# EAGLE design hoop_v2 (EAGLE 9.6.2)
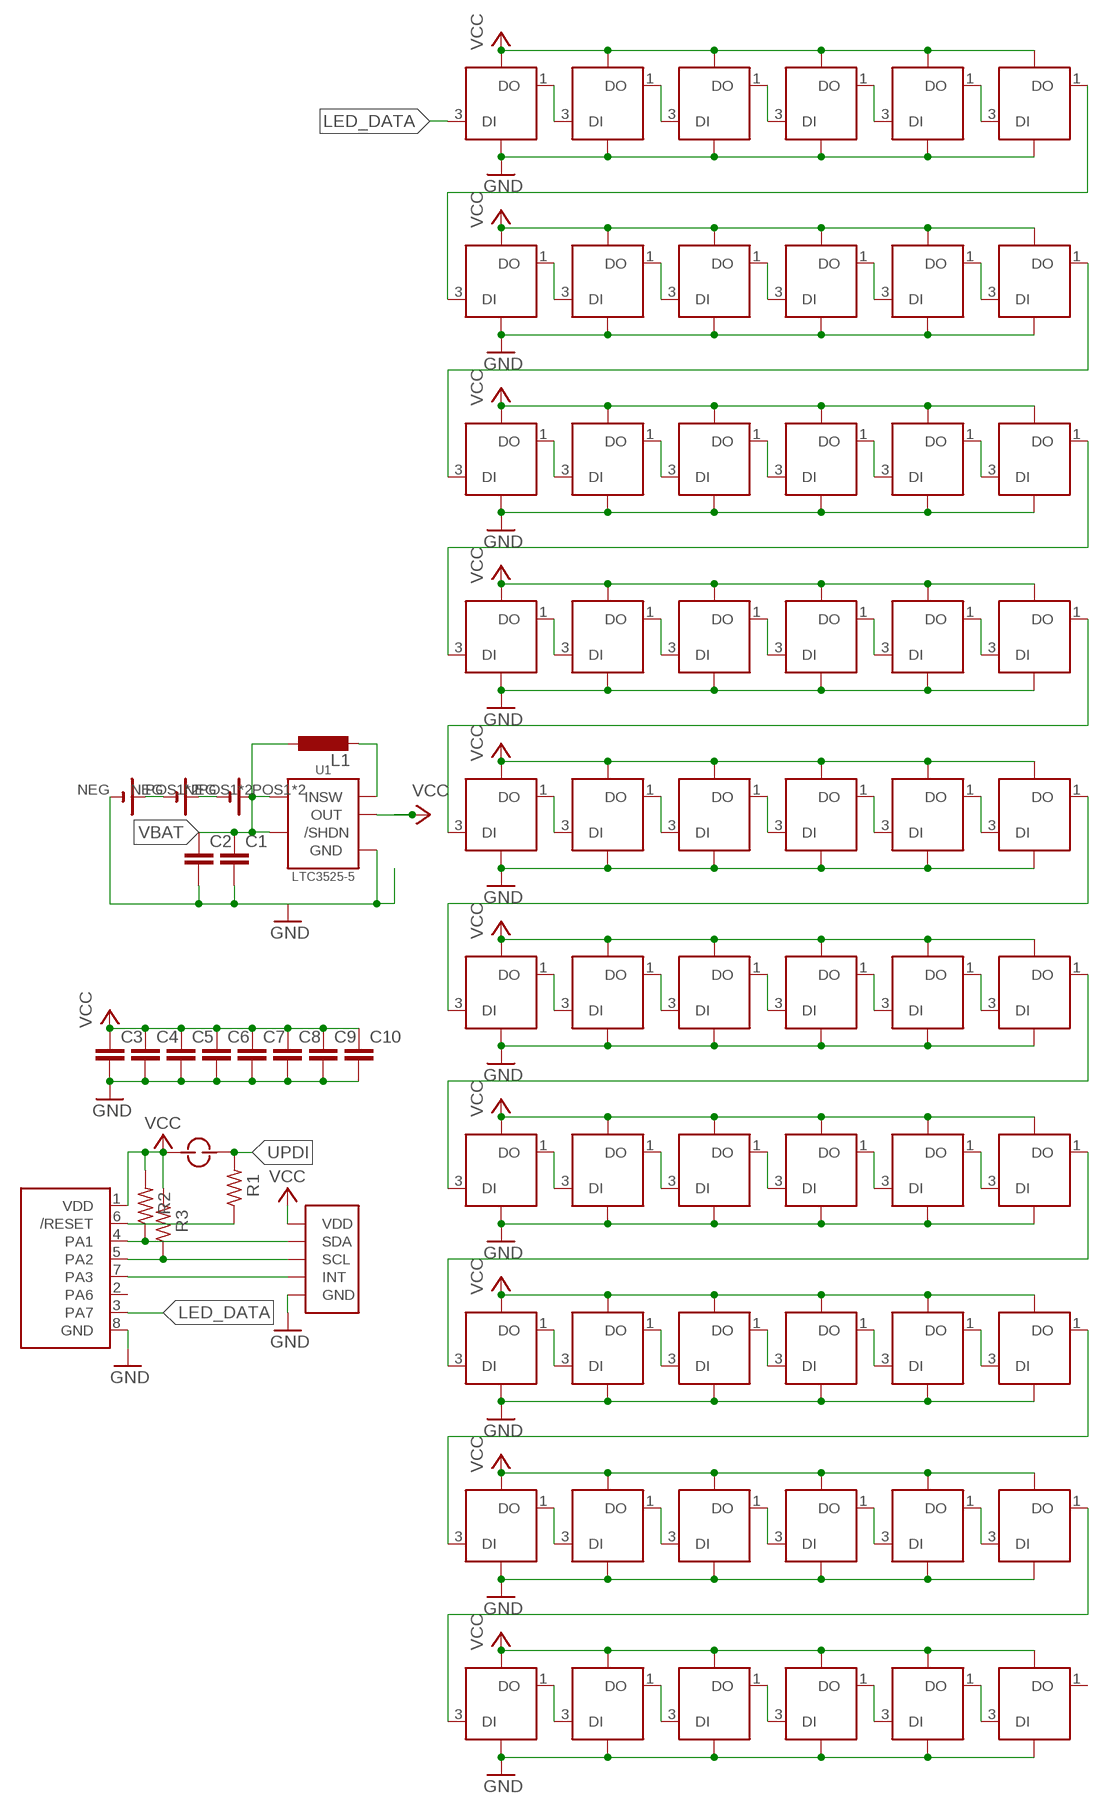
[diagram p0: schematic, sheet 1]

## Parts
B1  P312  [P312_CLIP]
B2  P312  [P312_CLIP]
B3  P312  [P312_CLIP]
C1  C-EUC0805  [C0805]
C2  C-EUC0805  [C0805]
C3  C-EUC0805  [C0805]
C4  C-EUC0805  [C0805]
C5  C-EUC0805  [C0805]
C6  C-EUC0805  [C0805]
C7  C-EUC0805  [C0805]
C8  C-EUC0805  [C0805]
C9  C-EUC0805  [C0805]
C10  C-EUC0805  [C0805]
D1  SMD-LX0707RGB-TR  [SMD-LX0707RGB-TR]
D2  SMD-LX0707RGB-TR  [SMD-LX0707RGB-TR]
D3  SMD-LX0707RGB-TR  [SMD-LX0707RGB-TR]
D4  SMD-LX0707RGB-TR  [SMD-LX0707RGB-TR]
D5  SMD-LX0707RGB-TR  [SMD-LX0707RGB-TR]
D6  SMD-LX0707RGB-TR  [SMD-LX0707RGB-TR]
D7  SMD-LX0707RGB-TR  [SMD-LX0707RGB-TR]
D8  SMD-LX0707RGB-TR  [SMD-LX0707RGB-TR]
D9  SMD-LX0707RGB-TR  [SMD-LX0707RGB-TR]
D10  SMD-LX0707RGB-TR  [SMD-LX0707RGB-TR]
D11  SMD-LX0707RGB-TR  [SMD-LX0707RGB-TR]
D12  SMD-LX0707RGB-TR  [SMD-LX0707RGB-TR]
D13  SMD-LX0707RGB-TR  [SMD-LX0707RGB-TR]
D14  SMD-LX0707RGB-TR  [SMD-LX0707RGB-TR]
D15  SMD-LX0707RGB-TR  [SMD-LX0707RGB-TR]
D16  SMD-LX0707RGB-TR  [SMD-LX0707RGB-TR]
D17  SMD-LX0707RGB-TR  [SMD-LX0707RGB-TR]
D18  SMD-LX0707RGB-TR  [SMD-LX0707RGB-TR]
D19  SMD-LX0707RGB-TR  [SMD-LX0707RGB-TR]
D20  SMD-LX0707RGB-TR  [SMD-LX0707RGB-TR]
D21  SMD-LX0707RGB-TR  [SMD-LX0707RGB-TR]
D22  SMD-LX0707RGB-TR  [SMD-LX0707RGB-TR]
D23  SMD-LX0707RGB-TR  [SMD-LX0707RGB-TR]
D24  SMD-LX0707RGB-TR  [SMD-LX0707RGB-TR]
D25  SMD-LX0707RGB-TR  [SMD-LX0707RGB-TR]
D26  SMD-LX0707RGB-TR  [SMD-LX0707RGB-TR]
D27  SMD-LX0707RGB-TR  [SMD-LX0707RGB-TR]
D28  SMD-LX0707RGB-TR  [SMD-LX0707RGB-TR]
D29  SMD-LX0707RGB-TR  [SMD-LX0707RGB-TR]
D30  SMD-LX0707RGB-TR  [SMD-LX0707RGB-TR]
D31  SMD-LX0707RGB-TR  [SMD-LX0707RGB-TR]
D32  SMD-LX0707RGB-TR  [SMD-LX0707RGB-TR]
D33  SMD-LX0707RGB-TR  [SMD-LX0707RGB-TR]
D34  SMD-LX0707RGB-TR  [SMD-LX0707RGB-TR]
D35  SMD-LX0707RGB-TR  [SMD-LX0707RGB-TR]
D36  SMD-LX0707RGB-TR  [SMD-LX0707RGB-TR]
D37  SMD-LX0707RGB-TR  [SMD-LX0707RGB-TR]
D38  SMD-LX0707RGB-TR  [SMD-LX0707RGB-TR]
D39  SMD-LX0707RGB-TR  [SMD-LX0707RGB-TR]
D40  SMD-LX0707RGB-TR  [SMD-LX0707RGB-TR]
D41  SMD-LX0707RGB-TR  [SMD-LX0707RGB-TR]
D42  SMD-LX0707RGB-TR  [SMD-LX0707RGB-TR]
D43  SMD-LX0707RGB-TR  [SMD-LX0707RGB-TR]
D44  SMD-LX0707RGB-TR  [SMD-LX0707RGB-TR]
D45  SMD-LX0707RGB-TR  [SMD-LX0707RGB-TR]
D46  SMD-LX0707RGB-TR  [SMD-LX0707RGB-TR]
D47  SMD-LX0707RGB-TR  [SMD-LX0707RGB-TR]
D48  SMD-LX0707RGB-TR  [SMD-LX0707RGB-TR]
D49  SMD-LX0707RGB-TR  [SMD-LX0707RGB-TR]
D50  SMD-LX0707RGB-TR  [SMD-LX0707RGB-TR]
D51  SMD-LX0707RGB-TR  [SMD-LX0707RGB-TR]
D52  SMD-LX0707RGB-TR  [SMD-LX0707RGB-TR]
D53  SMD-LX0707RGB-TR  [SMD-LX0707RGB-TR]
D54  SMD-LX0707RGB-TR  [SMD-LX0707RGB-TR]
D55  SMD-LX0707RGB-TR  [SMD-LX0707RGB-TR]
D56  SMD-LX0707RGB-TR  [SMD-LX0707RGB-TR]
D57  SMD-LX0707RGB-TR  [SMD-LX0707RGB-TR]
D58  SMD-LX0707RGB-TR  [SMD-LX0707RGB-TR]
D59  SMD-LX0707RGB-TR  [SMD-LX0707RGB-TR]
D60  SMD-LX0707RGB-TR  [SMD-LX0707RGB-TR]
J1  JMP  [SOLDER_JMP]
L1  L-EUL3216C  [L3216C]
R1  R-US_R0805  [R0805]
R2  R-US_R0805  [R0805]
R3  R-US_R0805  [R0805]
U1  LTC3525  [SOP65P210X100-6N]
U2  MXC6255XU  [RESCAV110P300X300X105-6N]
U3  ATTINY202  [SOIC127P600X175-8N]

## Nets
GND: B1.NEG(-) C1.2 C2.2 C3.2 C4.2 C5.2 C6.2 C7.2 C8.2 C9.2 C10.2 D1.4(GND) D2.4(GND) D3.4(GND) D4.4(GND) D5.4(GND) D6.4(GND) D7.4(GND) D8.4(GND) D9.4(GND) D10.4(GND) D11.4(GND) D12.4(GND) D13.4(GND) D14.4(GND) D15.4(GND) D16.4(GND) D17.4(GND) D18.4(GND) D19.4(GND) D20.4(GND) D21.4(GND) D22.4(GND) D23.4(GND) D24.4(GND) D25.4(GND) D26.4(GND) D27.4(GND) D28.4(GND) D29.4(GND) D30.4(GND) D31.4(GND) D32.4(GND) D33.4(GND) D34.4(GND) D35.4(GND) D36.4(GND) D37.4(GND) D38.4(GND) D39.4(GND) D40.4(GND) D41.4(GND) D42.4(GND) D43.4(GND) D44.4(GND) D45.4(GND) D46.4(GND) D47.4(GND) D48.4(GND) D49.4(GND) D50.4(GND) D51.4(GND) D52.4(GND) D53.4(GND) D54.4(GND) D55.4(GND) D56.4(GND) D57.4(GND) D58.4(GND) D59.4(GND) D60.4(GND) U1.2(GND) U1.5(GND) U2.6(GND) U3.8(GND)
LED_DATA: D1.3(DI) U3.3(PA7)
N$1: D1.1(DO) D2.3(DI)
N$2: D2.1(DO) D3.3(DI)
N$3: D3.1(DO) D4.3(DI)
N$4: D4.1(DO) D5.3(DI)
N$5: D5.1(DO) D6.3(DI)
N$6: D7.1(DO) D8.3(DI)
N$7: D8.1(DO) D9.3(DI)
N$8: D9.1(DO) D10.3(DI)
N$9: D10.1(DO) D11.3(DI)
N$10: D11.1(DO) D12.3(DI)
N$11: D13.1(DO) D14.3(DI)
N$12: D14.1(DO) D15.3(DI)
N$13: D15.1(DO) D16.3(DI)
N$14: D16.1(DO) D17.3(DI)
N$15: D17.1(DO) D18.3(DI)
N$16: D19.1(DO) D20.3(DI)
N$17: D20.1(DO) D21.3(DI)
N$18: D21.1(DO) D22.3(DI)
N$19: D22.1(DO) D23.3(DI)
N$20: D23.1(DO) D24.3(DI)
N$21: D25.1(DO) D26.3(DI)
N$22: D26.1(DO) D27.3(DI)
N$23: D27.1(DO) D28.3(DI)
N$24: D28.1(DO) D29.3(DI)
N$25: B1.POS1(+) B1.POS2(+) B2.NEG(-)
N$26: B2.POS1(+) B2.POS2(+) B3.NEG(-)
N$28: D29.1(DO) D30.3(DI)
N$29: D31.1(DO) D32.3(DI)
N$30: D32.1(DO) D33.3(DI)
N$31: D33.1(DO) D34.3(DI)
N$32: D34.1(DO) D35.3(DI)
N$33: D35.1(DO) D36.3(DI)
N$34: D37.1(DO) D38.3(DI)
N$35: D38.1(DO) D39.3(DI)
N$36: D39.1(DO) D40.3(DI)
N$37: D40.1(DO) D41.3(DI)
N$38: D41.1(DO) D42.3(DI)
N$39: D43.1(DO) D44.3(DI)
N$40: D44.1(DO) D45.3(DI)
N$41: D45.1(DO) D46.3(DI)
N$42: D46.1(DO) D47.3(DI)
N$43: D47.1(DO) D48.3(DI)
N$44: D49.1(DO) D50.3(DI)
N$45: D50.1(DO) D51.3(DI)
N$46: D51.1(DO) D52.3(DI)
N$47: D52.1(DO) D53.3(DI)
N$48: D53.1(DO) D54.3(DI)
N$49: D55.1(DO) D56.3(DI)
N$50: D56.1(DO) D57.3(DI)
N$51: D57.1(DO) D58.3(DI)
N$52: D58.1(DO) D59.3(DI)
N$53: D59.1(DO) D60.3(DI)
N$54: D6.1(DO) D7.3(DI)
N$55: D12.1(DO) D13.3(DI)
N$56: D18.1(DO) D19.3(DI)
N$57: D24.1(DO) D25.3(DI)
N$58: D30.1(DO) D31.3(DI)
N$59: D36.1(DO) D37.3(DI)
N$60: D42.1(DO) D43.3(DI)
N$61: D48.1(DO) D49.3(DI)
N$62: D54.1(DO) D55.3(DI)
N$64: L1.2 U1.6(SW)
N$66: U2.1(INT) U3.7(PA3)
N$69: R1.1 U3.6(/RESET)
SCL: R3.1 U2.4(SCL) U3.5(PA2)
SDA: R2.1 U2.5(SDA) U3.4(PA1)
UPDI: J1.P$2 R1.2
VBAT: B3.POS1(+) B3.POS2(+) C1.1 C2.1 L1.1 U1.1(/SHDN) U1.3(IN)
VCC: C3.1 C4.1 C5.1 C6.1 C7.1 C8.1 C9.1 C10.1 D1.2(VDD) D2.2(VDD) D3.2(VDD) D4.2(VDD) D5.2(VDD) D6.2(VDD) D7.2(VDD) D8.2(VDD) D9.2(VDD) D10.2(VDD) D11.2(VDD) D12.2(VDD) D13.2(VDD) D14.2(VDD) D15.2(VDD) D16.2(VDD) D17.2(VDD) D18.2(VDD) D19.2(VDD) D20.2(VDD) D21.2(VDD) D22.2(VDD) D23.2(VDD) D24.2(VDD) D25.2(VDD) D26.2(VDD) D27.2(VDD) D28.2(VDD) D29.2(VDD) D30.2(VDD) D31.2(VDD) D32.2(VDD) D33.2(VDD) D34.2(VDD) D35.2(VDD) D36.2(VDD) D37.2(VDD) D38.2(VDD) D39.2(VDD) D40.2(VDD) D41.2(VDD) D42.2(VDD) D43.2(VDD) D44.2(VDD) D45.2(VDD) D46.2(VDD) D47.2(VDD) D48.2(VDD) D49.2(VDD) D50.2(VDD) D51.2(VDD) D52.2(VDD) D53.2(VDD) D54.2(VDD) D55.2(VDD) D56.2(VDD) D57.2(VDD) D58.2(VDD) D59.2(VDD) D60.2(VDD) J1.P$1 R2.2 R3.2 U1.4(OUT) U2.3(VDD) U3.1(VDD)
Unconnected: D60.1(DO) U3.2(PA6)

## Library data of the parts
B1-B3 = earring:P312
C1-C10 = rcl:C-EU: CAPACITOR, European symbol; SPICEPREFIX: C
D1-D60 = earring:SMD-LX0707RGB-TR
J1 = earring:JMP
L1 = rcl:L-EU: INDUCTOR, European symbol; SPICEPREFIX: L
R1-R3 = rcl:R-US_: RESISTOR, American symbol; SPICEPREFIX: R
U1 = earring:LTC3525
U2 = earring:MXC6255XU
U3 = earring:ATTINY202

## Board
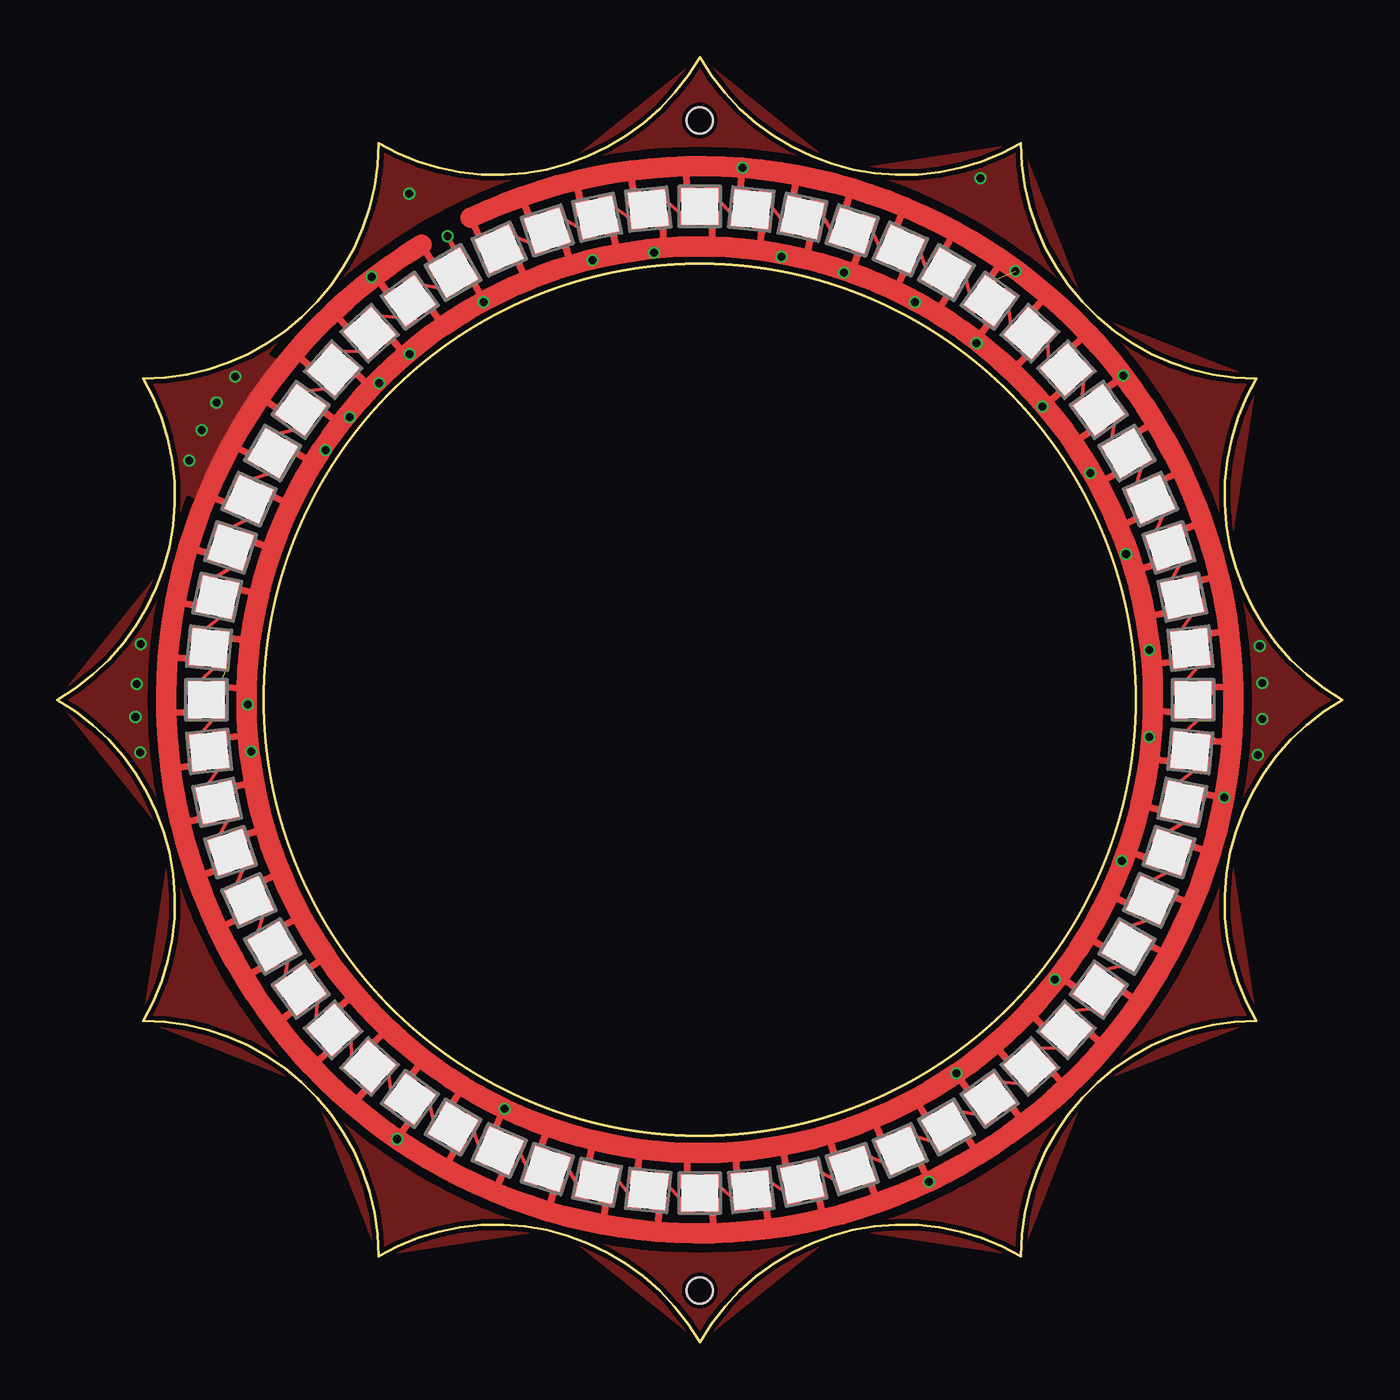
[diagram p1: board, top side]
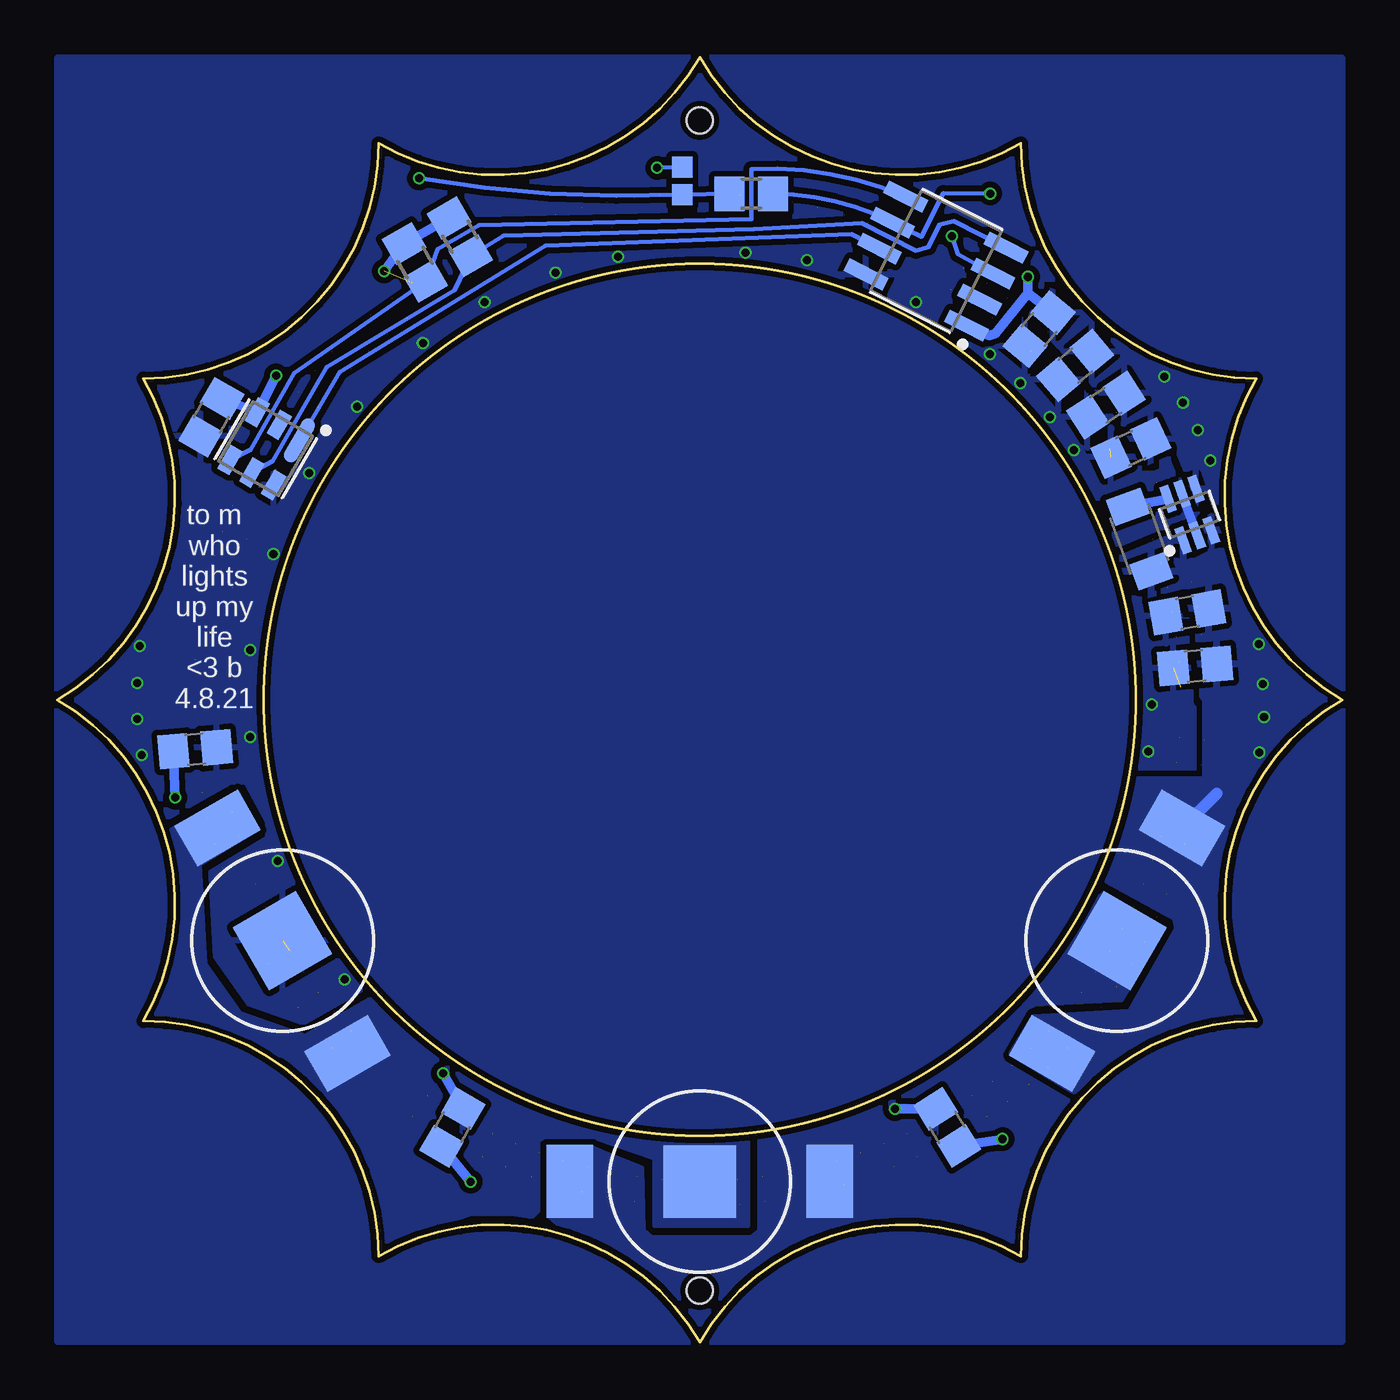
[diagram p2: board, bottom side, seen from below]

Size 56 x 56 mm. Coordinates in mm from the lower left corner, seen from the top.
Outline: 56,28 arc-90 52.25,42 arc-90 42,52.25 arc-90 28,56 arc-90 14,52.25 arc-90 3.75,42 arc-90 0,28 arc-90 3.75,14 arc-90 14,3.75 arc-90 28,0 arc-90 42,3.75 arc-90 52.25,14 arc-90 56,28
Outline: circle at 28,28 radius 19
Copper layers (1*16): Top 0.035559375mm / dielectric 1.6mm / Bottom 0.035559375mm
Design rules "jlcpcb2layer *": minimum track width 5mil, minimum drill 12mil, track to track 5mil, track to pad 5mil, pad to pad 5mil, via to via 5mil, smd to smd 5mil, copper to edge 8mil, drill to drill 6mil, minimum pad ring 5mil, minimum via ring 3mil, stop-mask expansion 2.5mil, vias tented up to drill 25mil, thermal gap 10mil
Holes 1.15 mm at 28,53.25 28,2.25

### Footprints (pad centres in the part's own frame; a part is rotated, then mirrored left to right if it is on the bottom)
P312_CLIP = smd 3.17 x 3.17: NEG 0,0 | smd 2.03 x 3.18: POS1 -5.665,0; POS2 5.665,0
C0805 = smd 1.3 x 1.5: 1 -0.95,0; 2 0.95,0
SMD-LX0707RGB-TR = smd 0.7 x 0.7: 1 0.55,0.55; 2 0.55,-0.55; 3 -0.55,-0.55; 4 -0.55,0.55
SOLDER_JMP = smd 0.9 x 0.9: P$1 -0.6,0; P$2 0.6,0
L3216C = smd 1.2 x 1.6: 1 -1.5,0; 2 1.5,0
R0805 = smd 1.3 x 1.5: 1 -0.95,0; 2 0.95,0
SOP65P210X100-6N = smd 1.186 x 0.397: 1 -0.962,0.65; 2 -0.962,0; 3 -0.962,-0.65; 4 0.962,-0.65; 5 0.962,0; 6 0.962,0.65
RESCAV110P300X300X105-6N = smd 2.1 x 0.6: 1 -1.05,1.1 | smd 1.2 x 0.6: 2 -1.2,0; 3 -1.2,-1.1; 4 1.2,-1.1; 5 1.2,0; 6 1.2,1.1
SOIC127P600X175-8N = smd 1.901 x 0.599: 1 -2.455,1.905; 2 -2.455,0.635; 3 -2.455,-0.635; 4 -2.455,-1.905; 5 2.455,-1.905; 6 2.455,-0.635; 7 2.455,0.635; 8 2.455,1.905

### Placement (x,y rotation side)
B1  46.19,17.5 300 bottom
B2  28,7 180 bottom
B3  9.81,17.5 60 bottom
C1  6.41,29.47 185 bottom
C2  6.75,31.81 190 bottom
C3  9.21,38.97 205 bottom
C4  13.21,44.15 230 bottom
C5  10.3,40.84 213 bottom
C6  49.29,40.31 240 bottom
C7  11.63,42.57 220 bottom
C8  38.78,9.36 60 bottom
C9  17.21,9.36 122 bottom
C10  50,25.84 5 bottom
D1  17.25,46.62 210 top
D2  15.36,45.39 216 top
D3  13.61,43.98 222 top
D4  12.02,42.39 228 top
D5  10.61,40.64 234 top
D6  9.38,38.75 240 top
D7  8.36,36.74 246 top
D8  7.55,34.64 252 top
D9  6.97,32.47 258 top
D10  6.62,30.25 264 top
D11  6.5,28 270 top
D12  6.62,25.75 276 top
D13  6.97,23.53 282 top
D14  7.55,21.36 288 top
D15  8.36,19.26 294 top
D16  9.38,17.25 300 top
D17  10.61,15.36 306 top
D18  12.02,13.61 312 top
D19  13.61,12.02 318 top
D20  15.36,10.61 324 top
D21  17.25,9.38 330 top
D22  19.26,8.36 336 top
D23  21.36,7.55 342 top
D24  23.53,6.97 348 top
D25  25.75,6.62 354 top
D26  28,6.5 0 top
D27  30.25,6.62 6 top
D28  32.47,6.97 12 top
D29  34.64,7.55 18 top
D30  36.74,8.36 24 top
D31  38.75,9.38 30 top
D32  40.64,10.61 36 top
D33  42.39,12.02 42 top
D34  43.98,13.61 48 top
D35  45.39,15.36 54 top
D36  46.62,17.25 60 top
D37  47.64,19.26 66 top
D38  48.45,21.36 72 top
D39  49.03,23.53 78 top
D40  49.38,25.75 84 top
D41  49.5,28 90 top
D42  49.38,30.25 96 top
D43  49.03,32.47 102 top
D44  48.45,34.64 108 top
D45  47.64,36.74 114 top
D46  46.62,38.75 120 top
D47  45.39,40.64 126 top
D48  43.98,42.39 132 top
D49  42.39,43.98 138 top
D50  40.64,45.39 144 top
D51  38.75,46.62 150 top
D52  36.74,47.64 156 top
D53  34.64,48.45 162 top
D54  32.47,49.03 168 top
D55  30.25,49.38 174 top
D56  28,49.5 180 top
D57  25.75,49.38 186 top
D58  23.53,49.03 192 top
D59  21.36,48.45 198 top
D60  19.26,47.64 204 top
J1  28.76,50.61 270 bottom
L1  8.83,35.01 110 bottom
R1  25.75,50.05 180 bottom
R2  38.45,48.18 120 bottom
R3  40.41,47.06 120 bottom
U1  6.65,36.07 110 bottom
U2  46.93,38.94 240 bottom
U3  17.7,47.12 153 bottom

### Tracks (layer width: path | path; a pad name or v marks a point on that pad's centre or on a via)
GND  (via drill 0.35)  (45 unrouted)
  Top 0.3: D1.4 18.57,45.36 | D2.4 16.81,44.28 | D3.4 15.17,43.02 | D4.4 13.67,41.6 | D5.4 12.33,40.03 | D6.4 11.15,38.32 | D7.4 10.17,36.51 | D8.4 9.38,34.6 | D9.4 8.79,32.61 | D10.4 8.41,30.58 | D11.4 8.25,28.52 | D12.4 8.3,26.45 | D13.4 8.57,24.4 | D14.4 9.06,22.39 | D15.4 9.75,20.44 | D16.4 10.64,18.57 | D17.4 11.72,16.81 | D18.4 12.98,15.17 | D19.4 14.4,13.67 | D20.4 15.97,12.33 | D21.4 17.68,11.15 | D22.4 v19.49,10.17 | D23.4 21.4,9.38 | D24.4 23.39,8.79 | D25.4 25.42,8.41 | D26.4 27.48,8.25 | D27.4 29.55,8.3 | D28.4 31.6,8.57 | D29.4 33.61,9.06 | D30.4 35.56,9.75 | D31.4 37.43,10.64 | D32.4 v39.19,11.72 | D33.4 40.83,12.98 | D34.4 42.33,14.4 | D35.4 43.67,15.97 | D36.4 44.84,17.68 | D37.4 45.83,19.49 | D38.4 46.62,21.4 | D39.4 47.21,23.39 | D40.4 47.59,25.42 | D41.4 47.75,27.48 | D42.4 47.7,29.55 | D43.4 47.43,31.6 | D44.4 46.94,33.61 | D45.4 46.25,35.56 | D46.4 45.36,37.43 | D47.4 44.28,39.19 | D48.4 43.02,40.83 | D49.4 41.6,42.33 | D50.4 40.03,43.67 | D51.4 38.32,44.84 | D52.4 36.51,45.83 | D53.4 34.6,46.62 | D54.4 32.61,47.21 | D55.4 30.58,47.59 | D56.4 28.52,47.75 | D57.4 26.45,47.7 | D58.4 24.4,47.43 | D59.4 22.39,46.94 | D60.4 20.44,46.25
  Top 0.9: 18.57,45.36 arc6 16.81,44.28 arc6 15.17,43.02 arc6 13.67,41.6 arc6 12.33,40.03 arc6 11.15,38.32 arc6 10.17,36.51 arc6 9.38,34.6 arc6 8.79,32.61 arc6 8.41,30.58 arc6 8.25,28.52 arc6 8.3,26.45 arc6 8.57,24.4 arc6 9.06,22.39 arc6 9.75,20.44 arc6 10.64,18.57 arc6 11.72,16.81 arc6 12.98,15.17 arc6 14.4,13.67 arc6 15.97,12.33 arc6 17.68,11.15 arc6 v19.49,10.17 arc6 21.4,9.38 arc6 23.39,8.79 arc6 25.42,8.41 arc6 27.48,8.25 arc6 29.55,8.3 arc6 31.6,8.57 arc6 33.61,9.06 arc6 35.56,9.75 arc6 37.43,10.64 arc6 v39.19,11.72 arc6 40.83,12.98 arc6 42.33,14.4 arc6 43.67,15.97 arc6 44.84,17.68 arc6 45.83,19.49 arc6 46.62,21.4 arc6 47.21,23.39 arc6 47.59,25.42 arc6 47.75,27.48 arc6 47.7,29.55 arc6 47.43,31.6 arc6 46.94,33.61 arc6 46.25,35.56 arc6 45.36,37.43 arc6 44.28,39.19 arc6 43.02,40.83 arc6 41.6,42.33 arc6 40.03,43.67 arc6 38.32,44.84 arc6 36.51,45.83 arc6 34.6,46.62 arc6 32.61,47.21 arc6 30.58,47.59 arc6 28.52,47.75 arc6 26.45,47.7 arc6 24.4,47.43 arc6 22.39,46.94 arc6 20.44,46.25 arc6 18.57,45.36
  Bottom 0.406: C9.2 v19.49,10.17 | C8.2 v39.19,11.72 | U1.2 U1.5
  other vias: 8.29,27.8 45.02,37.87 46.58,34.35 42.94,40.78 47.59,26.38 47.59,30.18 46.41,20.97 43.48,15.81 52.52,27.16 11.7,38.87 12.74,40.32 14.03,41.8 15.35,43.07 8.45,25.74 18.58,45.33 23.33,47.16 26,47.49 31.56,47.31 34.28,46.62 37.38,45.33 40.07,43.55 52.31,25.59 52.52,28.74 52.42,30.34
  pour Bottom (isolate 0.254, rank 3): 0,0 56,0 56,56 1,56 0,56
  pour Top: 51.4,22.25 51.46,22.5 51.52,22.74 51.57,22.99 51.62,23.24 51.67,23.48 51.72,23.73 51.76,23.98 51.8,24.23 51.84,24.48 51.88,24.73 51.91,24.98 51.94,25.23 51.97,25.48 51.99,25.73 52.02,25.98 52.04,26.23 52.05,26.49 52.07,26.74 52.08,26.99 52.09,27.24 52.09,27.5 52.1,27.75 52.1,28 52.1,28.25 52.09,28.5 52.09,28.76 52.08,29.01 52.07,29.26 52.05,29.51 52.04,29.77 52.02,30.02 51.99,30.27 51.97,30.52 51.94,30.77 51.91,31.02 51.88,31.27 51.84,31.52 51.8,31.77 51.76,32.02 51.72,32.27 51.67,32.52 51.62,32.76 51.57,33.01 51.52,33.26 51.46,33.5 51.4,33.75 56,28
LED_DATA  (via drill 0.35)
  Top 0.203: D1.3 v17.02,48.21
  Bottom 0.203: v17.02,48.21 16.74,47.42 U3.3
N$1  (2 unrouted)
  Top 0.152: D1.1 D2.3
N$2  (2 unrouted)
  Top 0.152: D2.1 D3.3
N$3  (1 unrouted)
  Top 0.152: D3.1 D4.3
N$4
  Top 0.152: D4.1 D5.3
N$5  (2 unrouted)
  Top 0.152: D5.1 D6.3
N$6  (2 unrouted)
  Top 0.152: D7.1 D8.3
N$7  (2 unrouted)
  Top 0.152: D8.1 D9.3
N$8  (2 unrouted)
  Top 0.152: D9.1 D10.3
N$9  (1 unrouted)
  Top 0.152: D10.1 D11.3
N$10  (1 unrouted)
  Top 0.152: D11.1 D12.3
N$11  (1 unrouted)
  Top 0.152: D13.1 D14.3
N$12  (2 unrouted)
  Top 0.152: D14.1 D15.3
N$13  (2 unrouted)
  Top 0.152: D15.1 D16.3
N$14  (2 unrouted)
  Top 0.152: D16.1 D17.3
N$15  (2 unrouted)
  Top 0.152: D17.1 D18.3
N$16  (2 unrouted)
  Top 0.152: D19.1 D20.3
N$17  (2 unrouted)
  Top 0.152: D20.1 D21.3
N$18  (2 unrouted)
  Top 0.152: D21.1 D22.3
N$19  (1 unrouted)
  Top 0.152: D22.1 D23.3
N$20  (1 unrouted)
  Top 0.152: D23.1 D24.3
N$21  (1 unrouted)
  Top 0.152: D25.1 D26.3
N$22
  Top 0.152: D26.1 D27.3
N$23  (2 unrouted)
  Top 0.152: D27.1 D28.3
N$24  (1 unrouted)
  Top 0.152: D28.1 D29.3
N$25
  pour Bottom (isolate 0.254, no thermals): 25.91,8.76 25.91,5.08 29.97,5.08 29.97,8 32.51,8.89 34.92,8.89 35.05,8.76 35.05,5.71 35.31,5.46 36.2,5.59 37.97,5.59 42.09,4.17 46.41,12.67 42.34,14.99
  pour Bottom (no thermals): 46.23,12.45 52.96,13.08 51.05,22.35 48.13,24 47.24,22.35 49.78,20.83 49.53,16.51 48.01,14.35 45.09,13.34
N$26
  pour Bottom (isolate 0.254, no thermals): 30.51,7.59 32.31,8.31 32.77,8.51 34.54,8.51 34.54,5.46 28.57,0.25 25.53,0.13 12.06,4.7 11.56,10.16 11.96,10.57 14.76,12.22 14.86,12.55 13.72,14.58 13.39,14.73 9.6,14.91 7.75,18.03 10.41,19.56 25.4,9.07 25.4,4.88 25.78,4.57 30.1,4.57 30.45,4.88
N$28  (2 unrouted)
  Top 0.152: D29.1 D30.3
N$29  (2 unrouted)
  Top 0.152: D31.1 D32.3
N$30
  Top 0.152: D32.1 D33.3
N$31  (1 unrouted)
  Top 0.152: D33.1 D34.3
N$32  (2 unrouted)
  Top 0.152: D34.1 D35.3
N$33  (2 unrouted)
  Top 0.152: D35.1 D36.3
N$34  (2 unrouted)
  Top 0.152: D37.1 D38.3
N$35  (2 unrouted)
  Top 0.152: D38.1 D39.3
N$36  (1 unrouted)
  Top 0.152: D39.1 D40.3
N$37  (1 unrouted)
  Top 0.152: D40.1 D41.3
N$38  (1 unrouted)
  Top 0.152: D41.1 D42.3
N$39  (2 unrouted)
  Top 0.152: D43.1 D44.3
N$40  (2 unrouted)
  Top 0.152: D44.1 D45.3
N$41  (1 unrouted)
  Top 0.152: D45.1 D46.3
N$42
  Top 0.152: D46.1 D47.3
N$43  (2 unrouted)
  Top 0.152: D47.1 D48.3
N$44  (2 unrouted)
  Top 0.152: D49.1 D50.3
N$45
  Top 0.152: D50.1 D51.3
N$46  (2 unrouted)
  Top 0.152: D51.1 D52.3
N$47  (1 unrouted)
  Top 0.152: D52.1 D53.3
N$48  (1 unrouted)
  Top 0.152: D53.1 D54.3
N$49
  Top 0.152: D55.1 D56.3
N$50  (1 unrouted)
  Top 0.152: D56.1 D57.3
N$51  (1 unrouted)
  Top 0.152: D57.1 D58.3
N$52  (2 unrouted)
  Top 0.152: D58.1 D59.3
N$53
  Top 0.152: D59.1 D60.3
N$54  (2 unrouted)
  Top 0.152: D6.1 D7.3
N$55  (1 unrouted)
  Top 0.152: D12.1 D13.3
N$56  (2 unrouted)
  Top 0.152: D18.1 D19.3
N$57  (1 unrouted)
  Top 0.152: D24.1 D25.3
N$58  (2 unrouted)
  Top 0.152: D30.1 D31.3
N$59
  Top 0.152: D36.1 D37.3
N$60  (2 unrouted)
  Top 0.152: D42.1 D43.3
N$61  (2 unrouted)
  Top 0.152: D48.1 D49.3
N$62  (2 unrouted)
  Top 0.152: D54.1 D55.3
N$64
  Bottom 0.406: U1.6 L1.2
N$66
  Bottom 0.203: U3.7 21.39,48.28 34.72,47.8 43.69,42.29 U2.1
N$69  (via drill 0.35)
  Bottom 0.203: v15.34,50.06 17.37,50.09 18.34,48.18 U3.6 arc-27 R1.1
  pour Top: 21.28,51.14 21.03,51.07 20.79,51 20.55,50.92 20.31,50.84 20.07,50.76 19.84,50.68 19.6,50.59 19.36,50.5 19.13,50.41 18.89,50.31 18.66,50.22 18.43,50.12 18.2,50.02 17.97,49.91 17.74,49.81 17.51,49.7 17.28,49.59 17.06,49.47 16.83,49.36 16.61,49.24 16.39,49.12 16.17,49 15.95,48.87 15.73,48.74 15.52,48.61 15.3,48.48 15.09,48.35 14.87,48.21 14.66,48.07 14.45,47.93 14.25,47.79 14.04,47.64 13.83,47.5 13.63,47.35 13.43,47.2 13.23,47.04 13.03,46.89 12.83,46.73 12.64,46.57 12.44,46.41 12.25,46.24 12.06,46.08 11.87,45.91 11.69,45.74 11.5,45.57 11.32,45.39 14,52.25
PAD
  pour Top: 33.75,51.4 33.5,51.46 33.26,51.52 33.01,51.57 32.76,51.62 32.52,51.67 32.27,51.72 32.02,51.76 31.77,51.8 31.52,51.84 31.27,51.88 31.02,51.91 30.77,51.94 30.52,51.97 30.27,51.99 30.02,52.02 29.77,52.04 29.51,52.05 29.26,52.07 29.01,52.08 28.76,52.09 28.5,52.09 28.25,52.1 28,52.1 27.75,52.1 27.5,52.09 27.24,52.09 26.99,52.08 26.74,52.07 26.49,52.05 26.23,52.04 25.98,52.02 25.73,51.99 25.48,51.97 25.23,51.94 24.98,51.91 24.73,51.88 24.48,51.84 24.23,51.8 23.98,51.76 23.73,51.72 23.48,51.67 23.24,51.62 22.99,51.57 22.74,51.52 22.5,51.46 22.25,51.4 28,56
PAD7
  pour Top: 4.86,21.28 4.93,21.03 5,20.79 5.08,20.55 5.16,20.31 5.24,20.07 5.32,19.84 5.41,19.6 5.5,19.36 5.59,19.13 5.69,18.89 5.78,18.66 5.88,18.43 5.98,18.2 6.09,17.97 6.19,17.74 6.3,17.51 6.41,17.28 6.53,17.06 6.64,16.83 6.76,16.61 6.88,16.39 7,16.17 7.13,15.95 7.26,15.73 7.39,15.52 7.52,15.3 7.65,15.09 7.79,14.87 7.93,14.66 8.07,14.45 8.21,14.25 8.36,14.04 8.5,13.83 8.65,13.63 8.8,13.43 8.96,13.23 9.11,13.03 9.27,12.83 9.43,12.64 9.59,12.44 9.76,12.25 9.92,12.06 10.09,11.87 10.26,11.69 10.43,11.5 10.61,11.32 3.75,14
PAD8
  pour Top: 11.32,10.61 11.5,10.43 11.69,10.26 11.87,10.09 12.06,9.92 12.25,9.76 12.44,9.59 12.64,9.43 12.83,9.27 13.03,9.11 13.23,8.96 13.43,8.8 13.63,8.65 13.83,8.5 14.04,8.36 14.25,8.21 14.45,8.07 14.66,7.93 14.87,7.79 15.09,7.65 15.3,7.52 15.52,7.39 15.73,7.26 15.95,7.13 16.17,7 16.39,6.88 16.61,6.76 16.83,6.64 17.06,6.53 17.28,6.41 17.51,6.3 17.74,6.19 17.97,6.09 18.2,5.98 18.43,5.88 18.66,5.78 18.89,5.69 19.13,5.59 19.36,5.5 19.6,5.41 19.84,5.32 20.07,5.24 20.31,5.16 20.55,5.08 20.79,5 21.03,4.93 21.28,4.86 14,3.75
PAD9
  pour Top: 22.25,4.6 22.5,4.54 22.74,4.48 22.99,4.43 23.24,4.38 23.48,4.33 23.73,4.28 23.98,4.24 24.23,4.2 24.48,4.16 24.73,4.12 24.98,4.09 25.23,4.06 25.48,4.03 25.73,4.01 25.98,3.98 26.23,3.96 26.49,3.95 26.74,3.93 26.99,3.92 27.24,3.91 27.5,3.91 27.75,3.9 28,3.9 28.25,3.9 28.5,3.91 28.76,3.91 29.01,3.92 29.26,3.93 29.51,3.95 29.77,3.96 30.02,3.98 30.27,4.01 30.52,4.03 30.77,4.06 31.02,4.09 31.27,4.12 31.52,4.16 31.77,4.2 32.02,4.24 32.27,4.28 32.52,4.33 32.76,4.38 33.01,4.43 33.26,4.48 33.5,4.54 33.75,4.6 28,0
PAD10
  pour Top: 34.72,4.86 34.97,4.93 35.21,5 35.45,5.08 35.69,5.16 35.93,5.24 36.16,5.32 36.4,5.41 36.64,5.5 36.87,5.59 37.11,5.69 37.34,5.78 37.57,5.88 37.8,5.98 38.03,6.09 38.26,6.19 38.49,6.3 38.72,6.41 38.94,6.53 39.17,6.64 39.39,6.76 39.61,6.88 39.83,7 40.05,7.13 40.27,7.26 40.48,7.39 40.7,7.52 40.91,7.65 41.13,7.79 41.34,7.93 41.55,8.07 41.75,8.21 41.96,8.36 42.17,8.5 42.37,8.65 42.57,8.8 42.77,8.96 42.97,9.11 43.17,9.27 43.36,9.43 43.56,9.59 43.75,9.76 43.94,9.92 44.13,10.09 44.31,10.26 44.5,10.43 44.68,10.61 42,3.75
PAD11
  pour Top: 45.39,11.32 45.57,11.5 45.74,11.69 45.91,11.87 46.08,12.06 46.24,12.25 46.41,12.44 46.57,12.64 46.73,12.83 46.89,13.03 47.04,13.23 47.2,13.43 47.35,13.63 47.5,13.83 47.64,14.04 47.79,14.25 47.93,14.45 48.07,14.66 48.21,14.87 48.35,15.09 48.48,15.3 48.61,15.52 48.74,15.73 48.87,15.95 49,16.17 49.12,16.39 49.24,16.61 49.36,16.83 49.47,17.06 49.59,17.28 49.7,17.51 49.81,17.74 49.91,17.97 50.02,18.2 50.12,18.43 50.22,18.66 50.31,18.89 50.41,19.13 50.5,19.36 50.59,19.6 50.68,19.84 50.76,20.07 50.84,20.31 50.92,20.55 51,20.79 51.07,21.03 51.14,21.28 52.25,14
SCL
  Bottom 0.203: U3.5 arc-26 25.76,51.13 25.76,48.95 37.62,48.69 39.42,47.65 R3.1 45.67,42.24 47.57,38.91 U2.4
SDA
  Bottom 0.203: U3.4 16.92,48.87 17.55,48.72 18.03,47.73 18.57,47.57 20.93,48.77 25.63,48.51 36.55,48.23 R2.1 38.68,45.85 44.27,42.49 46.61,38.41 U2.5
UPDI  (via drill 0.35)
  Bottom 0.203: R1.2 J1.P$2 arc12 v40.23,50.72
  pour Top: 44.68,45.39 44.5,45.57 44.31,45.74 44.13,45.91 43.94,46.08 43.75,46.24 43.56,46.41 43.36,46.57 43.17,46.73 42.97,46.89 42.77,47.04 42.57,47.2 42.37,47.35 42.17,47.5 41.96,47.64 41.75,47.79 41.55,47.93 41.34,48.07 41.13,48.21 40.91,48.35 40.7,48.48 40.48,48.61 40.27,48.74 40.05,48.87 39.83,49 39.61,49.12 39.39,49.24 39.17,49.36 38.94,49.47 38.72,49.59 38.49,49.7 38.26,49.81 38.03,49.91 37.8,50.02 37.57,50.12 37.34,50.22 37.11,50.31 36.87,50.41 36.64,50.5 36.4,50.59 36.16,50.68 35.93,50.76 35.69,50.84 35.45,50.92 35.21,51 34.97,51.07 34.72,51.14 42,52.25
VBAT  (via drill 0.35)
  Bottom 0.508: 5.46,23.92 B3.POS2
  other vias: 3.63,30.43 3.61,25.7 3.45,28.68 3.4,27.25
  pour Bottom (isolate 0.254, no thermals): 13.46,14.22 9.27,14.45 7.24,18.03 7.34,18.44 10.29,20.07 11.81,21.46 10.97,24.58 6.02,24.59 6.02,28.17 1.82,28.08 -0.05,28.02 0.85,24.58 0.89,22.99 2.29,13.46 10.67,10.41 11.81,10.92 14.48,12.57
  pour Top: 4.6,33.75 4.54,33.5 4.48,33.26 4.43,33.01 4.38,32.76 4.33,32.52 4.28,32.27 4.24,32.02 4.2,31.77 4.16,31.52 4.12,31.27 4.09,31.02 4.06,30.77 4.03,30.52 4.01,30.27 3.98,30.02 3.96,29.77 3.95,29.51 3.93,29.26 3.92,29.01 3.91,28.76 3.91,28.5 3.9,28.25 3.9,28 3.9,27.75 3.91,27.5 3.91,27.24 3.92,26.99 3.93,26.74 3.95,26.49 3.96,26.23 3.98,25.98 4.01,25.73 4.03,25.48 4.06,25.23 4.09,24.98 4.12,24.73 4.16,24.48 4.2,24.23 4.24,23.98 4.28,23.73 4.33,23.48 4.38,23.24 4.43,22.99 4.48,22.74 4.54,22.5 4.6,22.25 0,28
  pour Bottom: 6.07,28.12 6.25,30.68 6.78,32.99 9.17,32.38 9.8,34.11 7.49,35.08 7.06,35.23 6.5,34.01 5.66,34.44 6.15,35.84 5.69,35.99 5.21,34.62 0.13,28.07 5.49,27.51
VCC  (via drill 0.35)  (43 unrouted)
  Top 0.3: D1.2 15.87,47.84 | D2.2 13.87,46.47 | D3.2 12.01,44.89 | D4.2 10.33,43.13 | D5.2 8.85,41.2 | D6.2 7.58,39.12 | D7.2 6.53,36.93 | D8.2 5.71,34.63 | D9.2 5.14,32.27 | D10.2 4.82,29.85 | D11.2 4.75,27.42 | D12.2 4.94,24.99 | D13.2 5.38,22.6 | D14.2 6.07,20.26 | D15.2 7,18.01 | D16.2 8.15,15.87 | D17.2 9.53,13.87 | D18.2 11.11,12.01 | D19.2 12.87,10.33 | D20.2 v14.8,8.85 | D21.2 16.88,7.58 | D22.2 19.07,6.53 | D23.2 21.37,5.71 | D24.2 23.73,5.14 | D25.2 26.15,4.82 | D26.2 28.58,4.75 | D27.2 31.01,4.94 | D28.2 33.4,5.38 | D29.2 35.74,6.07 | D30.2 v37.99,7 | D31.2 40.13,8.15 | D32.2 42.13,9.53 | D33.2 43.99,11.11 | D34.2 45.67,12.87 | D35.2 47.15,14.8 | D36.2 48.42,16.88 | D37.2 49.48,19.07 | D38.2 50.29,21.37 | D39.2 v50.86,23.73 | D40.2 51.18,26.15 | D41.2 51.25,28.58 | D42.2 51.06,31.01 | D43.2 50.62,33.4 | D44.2 49.93,35.74 | D45.2 49,37.99 | D46.2 47.84,40.13 | D47.2 v46.47,42.13 | D48.2 44.89,43.99 | D49.2 43.13,45.67 | D50.2 41.2,47.15 | D51.2 39.12,48.42 | D52.2 36.93,49.48 | D53.2 34.63,50.29 | D54.2 32.27,50.86 | D55.2 v29.85,51.18 | D56.2 27.42,51.25 | D57.2 24.99,51.06 | D58.2 22.6,50.62 | D59.2 20.26,49.93 | D60.2 18.01,49
  Top 0.9: 15.87,47.84 arc6 13.87,46.47 arc6 12.01,44.89 arc6 10.33,43.13 arc6 8.85,41.2 arc6 7.58,39.12 arc6 6.53,36.93 arc6 5.71,34.63 arc6 5.14,32.27 arc6 4.82,29.85 arc6 4.75,27.42 arc6 4.94,24.99 arc6 5.38,22.6 arc6 6.07,20.26 arc6 7,18.01 arc6 8.15,15.87 arc6 9.53,13.87 arc6 11.11,12.01 arc6 12.87,10.33 arc6 v14.8,8.85 arc6 16.88,7.58 arc6 19.07,6.53 arc6 21.37,5.71 arc6 23.73,5.14 arc6 26.15,4.82 arc6 28.58,4.75 arc6 31.01,4.94 arc6 33.4,5.38 arc6 35.74,6.07 arc6 v37.99,7 arc6 40.13,8.15 arc6 42.13,9.53 arc6 43.99,11.11 arc6 45.67,12.87 arc6 47.15,14.8 arc6 48.42,16.88 arc6 49.48,19.07 arc6 50.29,21.37 arc6 v50.86,23.73 arc6 51.18,26.15 arc6 51.25,28.58 arc6 51.06,31.01 arc6 50.62,33.4 arc6 49.93,35.74 arc6 49,37.99 arc6 47.84,40.13 arc6 v46.47,42.13 arc6 44.89,43.99 arc6 43.13,45.67 arc6 41.2,47.15 arc6 39.12,48.42 arc6 36.93,49.48 arc6 34.63,50.29 arc6 32.27,50.86 arc6 v29.85,51.18 arc6 27.42,51.25 arc6 24.99,51.06 arc6 22.6,50.62 arc6 20.26,49.93 arc6 18.01,49
  Bottom 0.203: J1.P$1 v29.85,51.18
  Bottom 0.406: C6.1 U2.3 v46.47,42.13 | C9.1 v14.8,8.85 | C8.1 v37.99,7 | C10.1 v50.86,23.73 | 12.55,44.82 C4.1 13.69,45.73 | 13.69,45.73 15.11,43.97 15.39,43.87 U3.1 | 13.69,45.73 v13.69,46.43 | R2.2 R3.2 v41.76,46.69
  other vias: 7.75,42.09 6.93,40.94 6.3,39.75 5.74,38.43
  pour Top: 51.14,34.72 51.07,34.97 51,35.21 50.92,35.45 50.84,35.69 50.76,35.93 50.68,36.16 50.59,36.4 50.5,36.64 50.41,36.87 50.31,37.11 50.22,37.34 50.12,37.57 50.02,37.8 49.91,38.03 49.81,38.26 49.7,38.49 49.59,38.72 49.47,38.94 49.36,39.17 49.24,39.39 49.12,39.61 49,39.83 48.87,40.05 48.74,40.27 48.61,40.48 48.48,40.7 48.35,40.91 48.21,41.13 48.07,41.34 47.93,41.55 47.79,41.75 47.64,41.96 47.5,42.17 47.35,42.37 47.2,42.57 47.04,42.77 46.89,42.97 46.73,43.17 46.57,43.36 46.41,43.56 46.24,43.75 46.08,43.94 45.91,44.13 45.74,44.31 45.57,44.5 45.39,44.68 52.25,42
  pour Bottom: 13.51,44.83 12.75,45.85 2.39,42.55 4.72,36.65 6.22,36.55 6.81,38.07 7.14,38.89 8.61,38.3 9.63,40.16 10.92,41.88 12.34,43.41 13.51,44.78
  pour Top: 10.61,44.68 10.43,44.5 10.26,44.31 10.09,44.13 9.92,43.94 9.76,43.75 9.59,43.56 9.43,43.36 9.27,43.17 9.11,42.97 8.96,42.77 8.8,42.57 8.65,42.37 8.5,42.17 8.36,41.96 8.21,41.75 8.07,41.55 7.93,41.34 7.79,41.13 7.65,40.91 7.52,40.7 7.39,40.48 7.26,40.27 7.13,40.05 7,39.83 6.88,39.61 6.76,39.39 6.64,39.17 6.53,38.94 6.41,38.72 6.3,38.49 6.19,38.26 6.09,38.03 5.98,37.8 5.88,37.57 5.78,37.34 5.69,37.11 5.59,36.87 5.5,36.64 5.41,36.4 5.32,36.16 5.24,35.93 5.16,35.69 5.08,35.45 5,35.21 4.93,34.97 4.86,34.72 3.75,42
  pour Top: 9.63,42.65 9.04,43 8.31,42.24 7.47,40.92 6.38,39.09 5.59,37.31 5.51,37.11 6.38,36.73 9.53,42.29

### Text on the board
bNames: to m / who / lights / up my / life / <3 b / 4.8.21